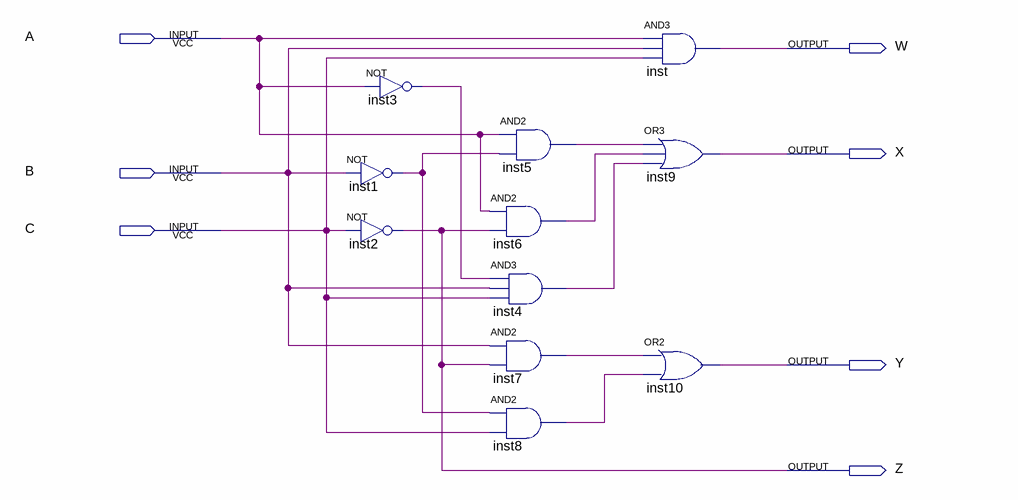
[diagram p0: schematic sheet]
// Quartus schematic NMMS4_3.bdf as structural Verilog: 11 symbols, 7 pins
module NMMS4_3 (
  input  A,
  input  B,
  input  C,
  output W,
  output X,
  output Y,
  output Z
);

  wire inst1_out, inst3_out, inst4_out, inst5_out, inst6_out, inst7_out, inst8_out;

  not inst1 (inst1_out, B);
  not inst2 (Z, C);
  not inst3 (inst3_out, A);
  and inst5 (inst5_out, A, inst1_out);
  and inst6 (inst6_out, A, Z);
  and inst4 (inst4_out, inst3_out, B, C);
  and inst7 (inst7_out, B, Z);
  and inst8 (inst8_out, inst1_out, C);
  and inst (W, A, B, C);
  or inst9 (X, inst5_out, inst6_out, inst4_out);
  or inst10 (Y, inst7_out, inst8_out);
endmodule
